# Altium schematic sheet Serial.SchDoc
size A4; Organization: Altium Limited; Address1: L3, 12a Rodborough Rd; Address2: Frenchs Forest; Address3: NSW; Address4: Australia 2086
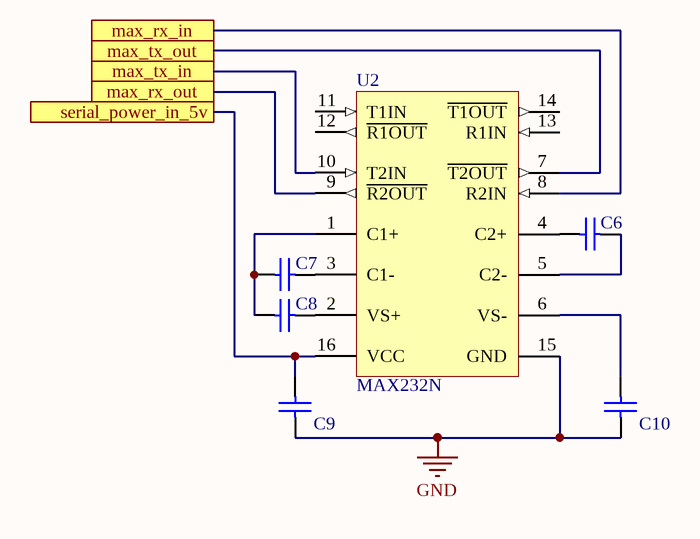
[diagram p0: Serial.SchDoc]

## Parts
C6  CAP_1_21_4  [0402]  (value not drawn)
C7  CAP_1_21_4  [0402]  (value not drawn)
C8  CAP_1_21_4  [0402]  (value not drawn)
C9  CAP_1_21_4  [0402]  (value not drawn)
C10  CAP_1_21_4  [0402]  (value not drawn)
U2  MAX232N  [N0016A]

## Ports
max_rx_in, max_rx_out, max_tx_in, max_tx_out, serial_power_in_5v

## Nets
GND: C9.1 C10.1 U2.15(GND)
max_rx_in: U2.8(R2IN) ; port max_rx_in
max_rx_out: U2.9(~{R2OUT}) ; port max_rx_out
max_tx_in: U2.10(T2IN) ; port max_tx_in
max_tx_out: U2.7(~{T2OUT}) ; port max_tx_out
serial_power_in_5v: C9.2 U2.16(VCC) ; port serial_power_in_5v
NetC6_1: C6.1 U2.4(C2+)
NetC6_2: C6.2 U2.5(C2-)
NetC7_1: C7.1 C8.1 U2.1(C1+)
NetC7_2: C7.2 U2.3(C1-)
NetC8_2: C8.2 U2.2(VS+)
NetC10_2: C10.2 U2.6(VS-)

Not connected (* = marked no-connect by the designer): U2 11(T1IN) 12(~{R1OUT}) 13(R1IN) 14(~{T1OUT})

## Notes on the sheet
- Title
- Size:
- Date:
- A4
- Number:
- Time:
- Revision:
- Sheet
- of
- File:

## Library data of the parts
C6-C10 = CAP_1_21_4: 1uF 10% 10V; Manufacturer: Samsung; Manufacturer Part Number: CL05A105MP5NNNC; Dielectric: X5R; Tolerance: 10%; Value: 1uF; Voltage: 10V; Supplier 1: Digi-Key; Supplier Part Number 1: 1276-1448-1-ND; Stock 1: 100000; Pricing 1: 1=0.1, 10=0.031, 100=0.014, 500=0.01002, 1000=0.00787, 2500=0.00716, 5000=0.00658 (USD); Mount: Surface Mount; Case/Package: 0402; Case Code (Metric): 1005; Case Code (Imperial): 0402; Min Operating Temperature: -55°C; Max Operating Temperature: 85°C; Package Quantity: 1; Packaging: Tape and Reel; Capacitance: 1uF; Voltage Rating: 10V; Voltage Rating (DC): 10V; Length: 1mm; Height: 0.5mm; Width: 0.02inch; Thickness: 0.022inch; Depth: 0.5mm; Radiation Hardening: No; Lead Free: Lead Free; ComponentLink1URL: https://media.digikey.com/pdf/Data%20Sheets/Samsung%20PDFs/CL_Series_MLCC_ds.pdf; ComponentLink1Description: https://media.digikey.com/pdf/Data%20Sheets/Samsung%20PDFs/CL_Series_MLCC_ds.pdf
U2 = CMP-0299-00084-2: Dual EIA-232 Driver / Receiver, 0 to 70 degC, 16-Pin PDIP (N), Pb-Free (RoHS); Single Supply: TRUE; ICC(Max)(mA): 10; SubFamily: RS-232; Supply Voltage(s)(V): 5; ESD HBM(kV): +/-2; Receivers Per Package: 2; ComponentLink1Description: Manufacturer URL; PackageDescription: 16-Pin Plastic Dual-In-Line Package, Row Spacing 7.62 mm, Pitch 2.54 mm; ComponentLink3Description: Package Specification; DatasheetVersion: SLLS047L; ComponentLink2URL: http://www.ti.com/general/docs/lit/getliterature.tsp?genericPartNumber=MAX232&fileType=pdf; RS-232: TRUE; ComponentLink3URL: http://www.ti.com/litv/pdf/mpdi002c; PackageReference: N0016A; PackageVersion: revE, Dec-2002; ComponentLink1URL: www.ti.com; Drivers Per Package: 2; ComponentLink2Description: Datasheet